# EAGLE design blsync (EAGLE 5.11)
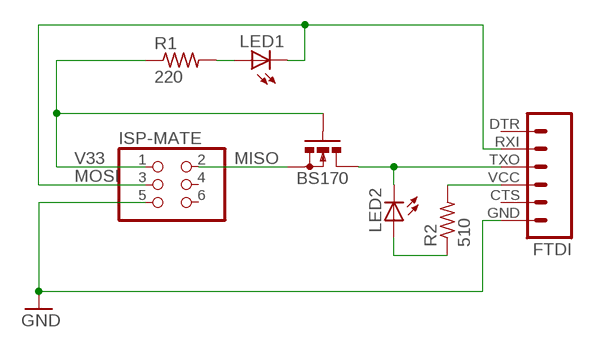
[diagram p0: schematic, sheet 1]

## Parts
FTDI  FTDI_BASICPTH  [FTDI_BASIC]
ISP-MATE  PINHD-2X3  [2X03]
LED1  LED5MM  [LED5MM]
LED2  LED5MM  [LED5MM]
Q1  BS170  [SOT54E]
R1  220  R-US_0207/10  [0207/10]
R2  510  R-US_0207/10  [0207/10]

## Nets
GND: FTDI.GND ISP-MATE.5
MISO: ISP-MATE.2 Q1.S
MOSI: FTDI.RXI ISP-MATE.3 LED1.K(C)
N$2: LED1.A R1.2
N$3: FTDI.TXO LED2.K(C) Q1.D
N$5: LED2.A R2.1
N$6: FTDI.VCC R2.2
V33: ISP-MATE.1 Q1.G R1.1
Unconnected: FTDI.CTS FTDI.DTR ISP-MATE.4 ISP-MATE.6

## Library data of the parts
FTDI = SparkFun:FTDI_BASIC: FTDI Basic: 3.3V and 5V
ISP-MATE = SparkFun:PINHD-2X3: PIN HEADER
LED1 LED2 = led:LED: LED OSRAM: - CHIPLED LG R971, LG N971, LY N971, LG Q971, LY Q971, LO R971, LY R971 LH N974, LH R974 LS Q976, LO Q976, LY Q976 LO Q996 - Hyper CHIPLED LW Q18S LB Q993, LB Q99A, LB R99A - SideLED LS A670, LO A670, LY A670, LG A670, LP A670 LB A673, LV A673, LT A673, LW A673 LH A674 LY A675 LS A676, LA A676, LO A676, LY A676, LW A676 LS A679, LY A679, LG A679 - Hyper Micro SIDELED® LS Y876, LA Y876, LO Y876, LY Y876 LT Y87S - SmartLED LW L88C, LW L88S LB L89C, LB L89S, LG L890 LS L89K, LO L89K, LY L89K LS L896, LA L896, LO L896, LY L896 - TOPLED LS T670, LO T670, LY T670, LG T670, LP T670 LSG T670, LSP T670, LSY T670, LOP T670, LYG T670 LG T671, LOG T671, LSG T671 LB T673, LV T673, LT T673, LW T673 LH T674 LS T676, LA T676, LO T676, LY T676, LB T676, LH T676, LSB T676, LW T676 LB T67C, LV T67C, LT T67C, LS T67K, LO T67K, LY T67K, LW E67C LS E67B, LA E67B, LO E67B, LY E67B, LB E67C, LV E67C, LT E67C LW T67C LS T679, LY T679, LG T679 LS T770, LO T770, LY T770, LG T770, LP T770 LB T773, LV T773, LT T773, LW T773 LH T774 LS E675, LA E675, LY E675, LS T675 LS T776, LA T776, LO T776, LY T776, LB T776 LHGB T686 LT T68C, LB T68C - Hyper Mini TOPLED® LB M676 - Mini TOPLED Santana® LG M470 LS M47K, LO M47K, LY M47K Source: http://www.osram.convergy.de LUXEON: - LUMILED® LXK2-PW12-R00, LXK2-PW12-S00, LXK2-PW14-U00, LXK2-PW14-V00 LXK2-PM12-R00, LXK2-PM12-S00, LXK2-PM14-U00 LXK2-PE12-Q00, LXK2-PE12-R00, LXK2-PE12-S00, LXK2-PE14-T00, LXK2-PE14-U00 LXK2-PB12-K00, LXK2-PB12-L00, LXK2-PB12-M00, LXK2-PB14-N00, LXK2-PB14-P00, LXK2-PB14-Q00 LXK2-PR12-L00, LXK2-PR12-M00, LXK2-PR14-Q00, LXK2-PR14-R00 LXK2-PD12-Q00, LXK2-PD12-R00, LXK2-PD12-S00 LXK2-PH12-R00, LXK2-PH12-S00 LXK2-PL12-P00, LXK2-PL12-Q00, LXK2-PL12-R00 Source: www.luxeon.com KINGBRIGHT: KA-3528ASYC Source: www.kingbright.com
Q1 = transistor-small-signal:BS170: N-CHANNEL MOS FET
R1 R2 = resistor:R-US_: RESISTOR, American symbol

## Board
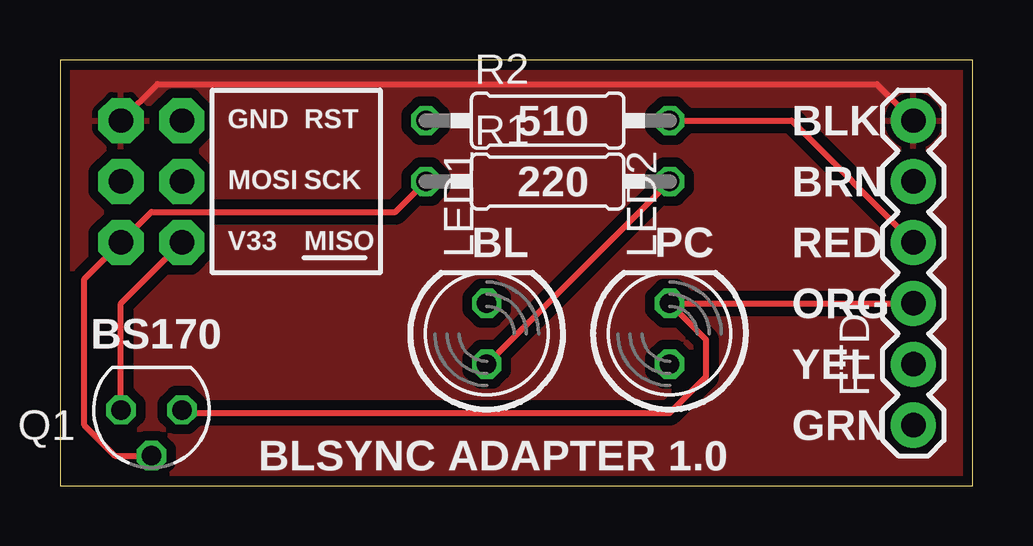
[diagram p1: board, top side]
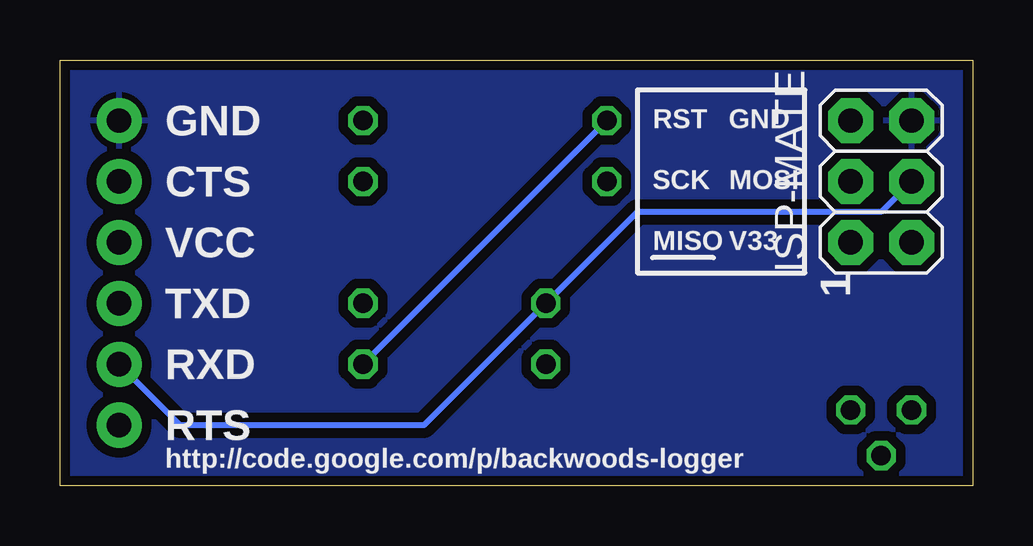
[diagram p2: board, bottom side, seen from below]

Size 38.02 x 17.77 mm. Coordinates in mm from the lower left corner, seen from the top.
Outline: 0,0 38.02,0 38.02,17.77 0,17.77 0,0
Copper layers (1*16): Top 0.0356mm / dielectric 1.5011mm / Bottom 0.0356mm
Design rules "LaenPCBOrder": minimum track width 6mil, minimum drill 13mil, track to track 6mil, track to pad 6mil, pad to pad 6mil, via to via 6mil, smd to smd 6mil, copper to edge 15mil, drill to drill 6mil, minimum pad ring 7mil, minimum via ring 7mil, stop-mask expansion 4mil, vias tented up to drill 0mil, thermal gap 10mil

### Footprints (pad centres in the part's own frame; a part is rotated, then mirrored left to right if it is on the bottom)
FTDI_BASIC = drill 1.016 pad 1.88 round: CTS 10.16,0; DTR 0,0; GND 12.7,0; RXI 2.54,0; TXO 5.08,0; VCC 7.62,0
2X03 = drill 1.016 pad 1.88 octagon: 1 -2.54,-1.27; 2 -2.54,1.27; 3 0,-1.27; 4 0,1.27; 5 2.54,-1.27; 6 2.54,1.27
LED5MM = drill 0.813 octagon: A -1.27,0; K 1.27,0
SOT54E = drill 0.813 octagon: D -1.27,0; G 0,1.905; S 1.27,0
0207/10 = drill 0.813 octagon: 1 -5.08,0; 2 5.08,0

### Placement (x,y rotation side)
FTDI  35.56,2.54 90 top
ISP-MATE  3.81,12.7 90 bottom
LED1  17.78,6.35 90 top
LED2  25.4,6.35 90 top
Q1  3.81,3.17 180 top
R1  20.32,12.7 0 top
R2  20.32,15.24 0 top

### Tracks (layer width: path | path; a pad name or v marks a point on that pad's centre or on a via)
GND
  Top 0.254: ISP-MATE.5 4.06,16.76 34.04,16.76 FTDI.GND
  pour Top (isolate 0.406): 0.51,17.27 37.59,17.27 37.59,0.51 0.51,0.51
  pour Bottom (isolate 0.406): 0.51,17.27 37.59,17.27 37.59,0.51 0.51,0.51
MISO
  Top 0.254: Q1.S 2.54,7.62 ISP-MATE.2
MOSI
  Bottom 0.254: ISP-MATE.3 3.81,11.43 13.97,11.43 LED1.K 22.86,2.54 33.02,2.54 FTDI.RXI
N$2
  Top 0.254: LED1.A R1.2
N$3
  Top 0.254: Q1.D 5.21,3.05 25.4,3.05 26.92,4.57 26.92,6.1 LED2.K FTDI.TXO
N$5
  Bottom 0.254: LED2.A R2.1
N$6
  Top 0.254: R2.2 30.48,15.24 FTDI.VCC
V33
  Top 0.254: Q1.G 2.29,1.27 1.02,2.54 1.02,8.64 ISP-MATE.1 3.81,11.43 13.97,11.43 R1.1

### Text on the board
tPlace: GND | RST | 510 | BLK | MOSI | SCK | 220 | BRN | V33 | MISO | BL | PC | RED | ORG | BS170 | YEL | GRN | BLSYNC ADAPTER 1.0
bPlace: GND | RST | GND | MOSI | SCK | CTS | V33 | MISO | VCC | 1 | TXD | RXD | RTS | http://code.google.com/p/backwoods-logger